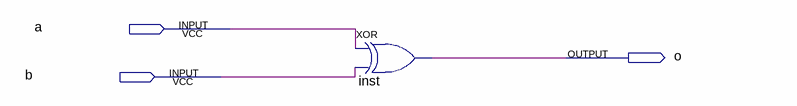
[diagram p0: schematic sheet]
// Quartus schematic XOR1.bdf as structural Verilog: 1 symbols, 3 pins
module XOR1 (
  input  a,
  input  b,
  output o
);

  xor inst (o, a, b);
endmodule
